# Altium schematic sheet 3.3V_5V_LogicLevelConverter_4x.SchDoc
size Letter
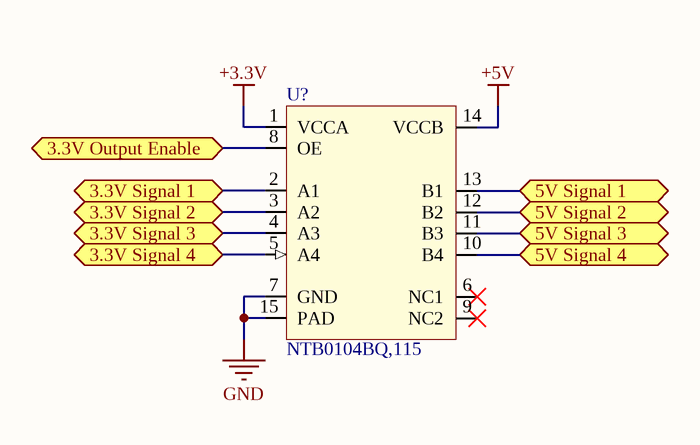
[diagram p0: 3.3V_5V_LogicLevelConverter_4x.SchDoc]

## Parts
U?  NTB0104BQ,115  [DHVQFN-14]

## Ports
3.3V Output Enable (bidir), 3.3V Signal 1 (bidir), 3.3V Signal 2 (bidir), 3.3V Signal 3 (bidir), 3.3V Signal 4 (bidir), 5V Signal 1 (bidir), 5V Signal 2 (bidir), 5V Signal 3 (bidir), 5V Signal 4 (bidir)

## Nets
+3.3V: U?.1(VCCA)
+5V: U?.14(VCCB)
GND: U?.7(GND) U?.15(PAD)
3.3V Output Enable: U?.8(OE) ; port 3.3V Output Enable
3.3V Signal 1: U?.2(A1) ; port 3.3V Signal 1
3.3V Signal 2: U?.3(A2) ; port 3.3V Signal 2
3.3V Signal 3: U?.4(A3) ; port 3.3V Signal 3
3.3V Signal 4: U?.5(A4) ; port 3.3V Signal 4
5V Signal 1: U?.13(B1) ; port 5V Signal 1
5V Signal 2: U?.12(B2) ; port 5V Signal 2
5V Signal 3: U?.11(B3) ; port 5V Signal 3
5V Signal 4: U?.10(B4) ; port 5V Signal 4

Not connected (* = marked no-connect by the designer): U? 6(NC1)* 9(NC2)*